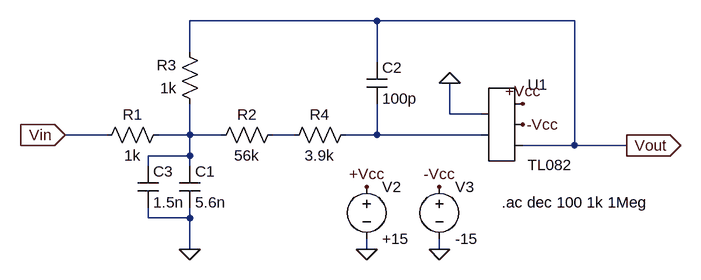
[diagram p0: schematic LPRauch4.asc]
LPRauch4.asc, the LTspice schematic file:
Version 4
SHEET 1 880 680
WIRE 48 -32 -240 -32
WIRE 352 -32 48 -32
WIRE -240 16 -240 -32
WIRE 48 32 48 -32
WIRE 160 112 160 64
WIRE 208 112 160 112
WIRE -368 144 -432 144
WIRE -240 144 -240 96
WIRE -240 144 -288 144
WIRE -192 144 -240 144
WIRE -80 144 -112 144
WIRE 48 144 48 96
WIRE 48 144 0 144
WIRE 208 144 48 144
WIRE 352 160 352 -32
WIRE 352 160 272 160
WIRE 432 160 352 160
WIRE -240 176 -240 144
WIRE -240 176 -304 176
WIRE -304 192 -304 176
WIRE -240 192 -240 176
WIRE -304 272 -304 256
WIRE -240 272 -240 256
WIRE -240 272 -304 272
WIRE -240 320 -240 272
WIRE 32 320 32 304
WIRE 144 320 144 304
FLAG 32 320 0
FLAG 144 320 0
FLAG 160 64 0
FLAG -240 320 0
FLAG -432 144 Vin
IOPIN -432 144 In
FLAG 432 160 Vout
IOPIN 432 160 Out
FLAG 272 96 +Vcc
FLAG 32 224 +Vcc
FLAG 272 128 -Vcc
FLAG 144 224 -Vcc
SYMBOL AutoGenerated\\TL082 240 128 R0
SYMATTR InstName U1
SYMBOL voltage 32 208 R0
WINDOW 123 0 0 Left 0
WINDOW 39 0 0 Left 0
SYMATTR InstName V2
SYMATTR Value +15
SYMBOL voltage 144 208 R0
WINDOW 123 0 0 Left 0
WINDOW 39 0 0 Left 0
SYMATTR InstName V3
SYMATTR Value -15
SYMBOL res -272 128 R90
WINDOW 0 0 56 VBottom 2
WINDOW 3 32 56 VTop 2
SYMATTR InstName R1
SYMATTR Value 1k
SYMBOL res -96 128 R90
WINDOW 0 0 56 VBottom 2
WINDOW 3 32 56 VTop 2
SYMATTR InstName R2
SYMATTR Value 56k
SYMBOL res -224 112 R180
WINDOW 0 36 76 Left 2
WINDOW 3 36 40 Left 2
SYMATTR InstName R3
SYMATTR Value 1k
SYMBOL cap -256 192 R0
SYMATTR InstName C1
SYMATTR Value 5.6n
SYMBOL cap 32 32 R0
SYMATTR InstName C2
SYMATTR Value 100p
SYMBOL cap -320 192 R0
SYMATTR InstName C3
SYMATTR Value 1.5n
SYMBOL res 16 128 R90
WINDOW 0 0 56 VBottom 2
WINDOW 3 32 56 VTop 2
SYMATTR InstName R4
SYMATTR Value 3.9k
TEXT 240 248 Left 2 !.ac dec 100 1k 1Meg

The netlist it stands for:
* LPRauch4.asc
* U1: TL082 (symbol AutoGenerated\TL082 not available, pins judged from their places): pin1=0 pin2=N003 pin3=+Vcc pin4=-Vcc pin5=Vout
V2 +Vcc 0 +15
V3 -Vcc 0 -15
R1 N001 Vin 1k
R2 N002 N001 56k
R3 N001 Vout 1k
C1 N001 0 5.6n
C2 Vout N003 100p
C3 N001 0 1.5n
R4 N003 N002 3.9k
.ac dec 100 1k 1Meg
.backanno
.end